# Altium schematic sheet Sheet1.SchDoc
size A4
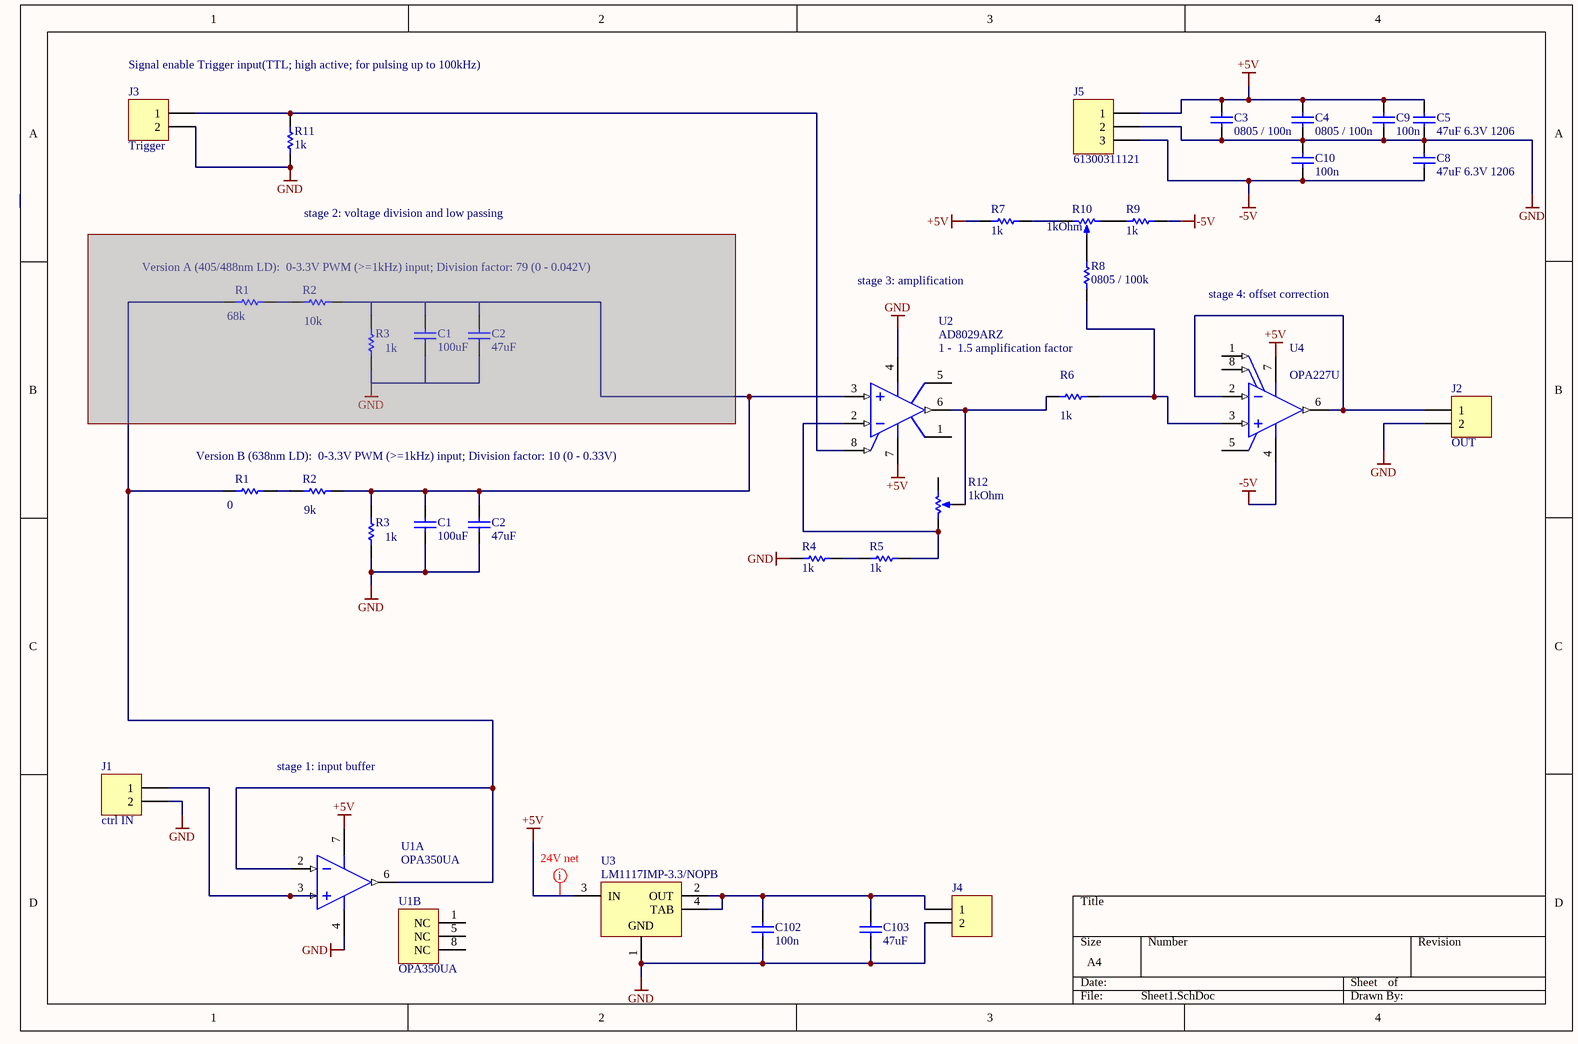
[diagram p0: Sheet1.SchDoc]

## Parts
(Parts that share a designator on the sheet are numbered #1, #2 ... from top to bottom, then left to right.)
C1#1  100uF  [CAPC1206(3216)190_L]  (masked out: inside a compile mask, not in the netlist)
C1#2  100uF  [CAPC1206(3216)190_L]
C2#1  47uF  [CAPC1206(3216)190_M]  (masked out: inside a compile mask, not in the netlist)
C2#2  47uF  [CAPC1206(3216)190_M]
C3  0805 / 100n  [CAPC2013X88X50LL20T25]
C4  0805 / 100n  [CAPC2013X88X50LL20T25]
C5  47uF 6.3V 1206  [CAPC1206(3216)190_M]
C8  47uF 6.3V 1206  [CAPC1206(3216)190_M]
C9  100n  [CAPC2013X88X50ML20T25]
C10  100n  [CAPC2013X88X50ML20T25]
C102  100n  [CAPC2013X88X50ML20T25]
C103  47uF  [CAPC1206(3216)190_M]
J1  ctrl IN  [61300211121]
J2  OUT  [61300211121]
J3  Trigger  [61300211121]
J4  potentiometer connect  [61300211121]  (value not drawn)
J5  61300311121  [61300311121]
R1#1  68k  [YAGO-RC0805_M]  (masked out: inside a compile mask, not in the netlist)
R1#2  0  [YAGO-RC0805_M]
R2#1  10k  [YAGO-RC0805_M]  (masked out: inside a compile mask, not in the netlist)
R2#2  9k  [YAGO-RC0805_M]
R3#1  1k  [YAGO-RC0805_M]  (masked out: inside a compile mask, not in the netlist)
R3#2  1k  [YAGO-RC0805_M]
R4  1k  [YAGO-RC0805_M]
R5  1k  [YAGO-RC0805_M]
R6  1k  [YAGO-RC0805_M]
R7  1k  [YAGO-RC0805_M]
R8  0805 / 100k  [YAGO-RC0805_M]
R9  1k  [YAGO-RC0805_M]
R10  1kOhm  [Typ 3296Y]
R11  1k  [YAGO-RC0805_M]
R12  1kOhm  [Typ 3296Y]
U1  OPA350UA  [D0008A_M]  (parts A,B of 2)
U2  AD8029ARZ  [ADI-R-8_L]
U3  LM1117IMP-3.3/NOPB  [DCY0004A_N]
U4  OPA227U  [D0008A_M]

## Nets
+5V: C3.2 C4.2 C5.2 C9.2 J5.1 R7.2 U1.7(V+) U2.7(+VS) U3.3(IN) U4.7(V+)
-5V: C8.1 C10.1 J5.3 R9.1 U4.4(V-)
GND: C1#2.1 C2#2.1 C3.1 C4.1 C5.1 C8.2 C9.1 C10.2 C102.1 C103.1 J1.2 J2.2 J3.2 J4.2 J5.2 R3#2.1 R4.2 R11.2 U1.4(V-) U2.4(-VS) U3.1(GND)
NetC1#2_2: C1#2.2 C2#2.2 R2#2.2 R3#2.2 U2.3(+IN)
NetC102_2: C102.2 C103.2 J4.1 U3.2(OUT) U3.4(TAB)
NetJ1_1: J1.1 U1.3(IN+)
NetJ2_1: J2.1 U4.2(IN-) U4.6(OUT)
NetJ3_1: J3.1 R11.1 U2.8(~{DISABLE})
NetR1#2_1: R1#2.1 U1.2(IN-) U1.6(OUT)
NetR1#2_2: R1#2.2 R2#2.1
NetR4_1: R4.1 R5.2
NetR5_1: R5.1 R12.3(CW) U2.2(-IN)
NetR6_1: R6.1 R8.1 U4.3(IN+)
NetR6_2: R6.2 R12.2(S) U2.6(VOUT)
NetR7_1: R7.1 R10.3(CW)
NetR8_2: R8.2 R10.2(S)
NetR9_2: R9.2 R10.1(CCW)

Not connected (* = marked no-connect by the designer): R12 1(CCW); U1 1(NC) 5(NC) 8(NC); U2 1(NC) 5(NC); U4 1(TRIM) 5(NC) 8(TRIM)

## Layout directives
net class 24V_net: +5V

## Notes on the sheet
- Signal enable Trigger input(TTL; high active; for pulsing up to 100kHz)
- stage 2: voltage division and low passing
- Version A (405/488nm LD):  0-3.3V PWM (>=1kHz) input; Division factor: 79 (0 - 0.042V)
- stage 3: amplification
- stage 4: offset correction
- 1 -  1.5 amplification factor
- Version B (638nm LD):  0-3.3V PWM (>=1kHz) input; Division factor: 10 (0 - 0.33V)
- stage 1: input buffer

## Library data of the parts
C1#1 C1#2 = CMP-00469-1: CAP 100uF 6.3V ±20% 1206 (3216 Metric) Thickness 1.9mm SMD; Tolerance: Â±20%; Case-EIA: 1206; Case-Metric: 3216; Technology: SMT; Max Thickness: 1.9 mm; Rated Voltage: 6.3 V; Value: 100uF
C2#1 C2#2 C5 C8 C103 = CMP-00470-A.1: CAP 47uF 6.3V ±20% 1206 (3216 Metric) Thickness 1.9mm SMD; Case-EIA: 1206; Case-Metric: 3216; Tolerance: Â±20%; Max Thickness: 1.9 mm; Value: 47uF; Technology: SMT; Rated Voltage: 6.3 V
C3 C4 = CMP-001-0082-1: generic_0805_example here 100nF: C0805C104K5RAC 7800 / SMD-Keramik-Vielschichtkondensator 100 nF, 50 VDC, 0805, ±10 %, X7R; Manufacturer: KEMET; Class: Class 1; Capacitance: 0.1 uF; Capacitance - nF: 100 nF; Capacitance - pF: 100000 pF; Tolerance: 10 %; Voltage Rating DC: 50 VDC; ComponentLink1Description: KEM_C1002_X7R_SMD-1102033.pdf; ComponentLink1URL: http://www.mouser.com/ds/2/212/KEM_C1002_X7R_SMD-1102033.pdf; Dielectric: X7R; Height: -; Length: 2 mm; Manufacturer Part Number: C0805C104K5RAC7800; Maximum Operating Temperature: + 125 C; Minimum Operating Temperature: - 55 C; Minimum Order Quantity: 4000; Package/Case: 0805 (2012 metric); Packaging: Reel; Product: General Type MLCCs; Reeling: True; RoHS - Mouser: Y; Series: C-C; Standard Pack Qty: 4000; Supplier: Mouser; Supplier Part Number: 80-C0805C104K5R7800; Brand: KEMET; Case Code - in: 0805; Case Code - mm: 2012; Termination: -; Termination Style: SMD/SMT; Voltage Rating AC: -; Width: 1.2 mm
C9 C10 C102 = CMP-001-0082-2: generic 0805 COG oder X7R Vielschichtkondensatoren max. +/-10%
J1-J4 = CMP-001-0071-1: 2Pol; gerade; WR-PHD 2.54 mm THT Pin Header; Brand: Wurth Electronics; Current Rating: 3 A; Insulation Resistance: 1 GOhms; Latching Type: Unlatched; Mating Post Length: 6 mm; Mounting Angle: Straight; Number of Positions: 2 Position; Pitch: 2.54 mm; Voltage Rating: 250 V; Accessory Type: -; Application: Wire to Board; ComponentLink1Description: 6130xx11121-538006.pdf; ComponentLink1URL: http://www.mouser.com/ds/2/445/6130xx11121-538006.pdf; Contact Gender: Pin (Male); Contact Material: Copper Alloy; Contact Plating: Gold; Contact Type: -; Flammability Rating: UL 94 V-0; Housing Gender: -; Housing Material: Polybutylene Terephthalate (PBT); Manufacturer: Wurth Electronics; Manufacturer Part Number: 61300211121; Minimum Order Quantity: 1; Mounting Style: Straight Pin; Number of Rows: 1 Row; Packaging: Bulk; Product: Headers; Reeling: False; RoHS - Mouser: Y; Row Spacing: -; Series: WR-PHD; Standard Pack Qty: 1000; Supplier: Mouser; Supplier Part Number: 710-61300211121; Termination Post Length: 3 mm; Termination Style: Through Hole; Type: Pin Strip; PartNumber: 61300211121
J5 = CMP-001-0072-1: 3Pol; gerade; WR-PHD 2.54 mm THT Pin Header; Brand: Wurth Electronics; Current Rating: 3 A; Insulation Resistance: 1 GOhms; Mating Post Length: 6 mm; Mounting Angle: Straight; Number of Positions: 3 Position; Pitch: 2.54 mm; Voltage Rating: 250 V; ComponentLink1Description: 6130xx11121-538006.pdf; ComponentLink1URL: http://www.mouser.com/ds/2/445/6130xx11121-538006.pdf; Contact Gender: Pin (Male); Contact Material: Copper Alloy; Contact Plating: Gold; Contact Type: -; Flammability Rating: UL 94 V-0; Housing Gender: -; Housing Material: Polyamide (PA); Manufacturer: Wurth Electronics; Manufacturer Part Number: 61300311121; Minimum Order Quantity: 1; Mounting Style: Straight Pin; Number of Rows: 1 Row; Packaging: Bulk; Product: Headers; Reeling: False; RoHS - Mouser: Y; Row Spacing: -; Series: WR-PHD; Standard Pack Qty: 1000; Supplier: Mouser; Supplier Part Number: 710-61300311121; Termination Post Length: 3 mm; Termination Style: Through Hole; Type: Pin Strip; PartNumber: 61300311121
R1#1 R1#2 R2#1 R2#2 R3#1 R3#2 R4-R9 R11 = CMP-001-0027-2: 0805 Yageo Standard BlackBox Resistors; Power (Watts): 0.125W, 1/8W; Temperature Coefficient: ±200ppm/°C; Tolerance: ±1%; ComponentLink1Description: PYu-RC_Group_51_RoHS_L_7.pdf; Part Status: Active; Size / Dimension: 0.079" L x 0.049" W (2.00mm x 1.25mm); Supplier Device Package: 0805; ComponentLink1URL: http://www.yageo.com/documents/recent/PYu-RC_Group_51_RoHS_L_7.pdf; Composition: Thick Film; Failure Rate: -; Features: Moisture Resistant; Height - Seated (Max): 0.024" (0.60mm); Manufacturer: Yageo; Operating Temperature: -55°C ~ 155°C; Package / Case: 0805 (2012 Metric); Packaging: Digi-Reel®
R10 R12 = CMP-001-0079-1: Trimmer_stehend_rechteckig_Verstellung-von-Seite; Manufacturer Part Number: 3296Y-1-102LF; Adjustment: Top Crossed; Brand: Bourns; Element Type: Cermet; Number of Turns: 25; Power Rating: 500 mW (1/2 W); Resistance: 1 kOhms; Temperature Coefficient: 100 PPM / C; Tolerance: 10 %; ComponentLink1Description: 296-776415.pdf; ComponentLink1URL: http://www.mouser.com/ds/2/54/296-776415.pdf; Length: 9.53 mm; Manufacturer: Bourns; Minimum Order Quantity: 1; Mounting: Panel Mount; Operating Temperature Range: - 55 C to + 150 C; Packaging: Tube; Product: Multiturn; Product Type: Square Trimming Potentiometer; Reeling: False; RoHS - Mouser: E; Series: 3296; Standard Pack Qty: 100; Supplier: Mouser; Supplier Part Number: 652-3296Y-1-102LF; Taper: Linear; Termination Style: Pin; Tradename: Trimpot; Type: Trimmers; Width: 9.53 mm; PartNumber: 3296Y-1-102LF
U1 = CMP-00488-1: High-Speed, Single-Supply, Rail-to-Rail Operational Amplifier MicroAmplifier(TM) Series, 2.7 to 5.5 V, -40 to 85 degC, 8-pin SOIC (D8), Green (RoHS & no Sb/Br); Manufacturer: Texas Instruments; IIB(Max)(pA): 10; Iq per channel(Max)(mA): 8.5; Number of Channels: 1; CMRR(Min)(dB): 66; Slew Rate(Typ)(V/us): 22; Total Supply Voltage(Max)(+5V is 5, +/-5V is 10): 5.5; Sub Family: Low Input Bias Current Amp (<=10pA), Low Offset Voltage Amplifier (<=500uV), Low Supply Voltage Amplifier (<=2.7V), Precision Amplifier; Offset Drift(Typ)(uV/C): 4; Total Supply Voltage(Min)(+5V is 5, +/-5V is 10): 2.7; Vn at 1kHz(Typ)(nV/rtHz): 18; PackageReference: D0008A; PackageDescription: 8-Pin Plastic Small Outline, Body 4.9 x 3.9 mm, Pitch 1.27 mm; Code_JEDEC: MS-012; Eco-Plan: Green (RoHS & no Sb/Br); DatasheetVersion: SBOS099C; Vio (25C)(Max)(mV): 1; ComponentLink1URL: http://www.ti.com/; ComponentLink3URL: http://www.ti.com/litv/pdf/msoi002j; PackageVersion: 4040047-3/M, 06/2011; ComponentLink3Description: Package Specification; ComponentLink2URL: http://www.ti.com/general/docs/lit/getliterature.tsp?genericPartNumber=OPA350&fileType=pdf; PartNumber: OPA350UA; ComponentLink2Description: Datasheet; ComponentLink1Description: Manufacturer URL; Mounting Technology: Surface Mount
U2 = CMP-00480-1: Single Channel RRIO Operational Amplifier, 125 MHz BW, 62 V/us SR, Industrial, 8-pin SOIC (R-8), Tube; Manufacturer: Analog Devices; Generic Part Number: AD8029; Slew Rate: 62V/us; V Span Min: 2.7V; Input Bias Current: 700nA; Amplifiers Per Package: 1; Iq/Amp: 1.5mA; V Span Max: 12V; Input Offset Voltage: 1.6mV; Small Signal Bandwidth: 125MHz; PackageVersion: 060506-A; ComponentLink3URL: http://www.analog.com/static/imported-files/packages/PKG_PDF/SOIC_Narrow%20(R)/R_8.pdf; ComponentLink1Description: Manufacturer URL; ComponentLink1URL: http://www.analog.com/en/index.html; Code_JEDEC: MS-012-AA; ComponentLink2URL: http://www.analog.com/static/imported-files/data_sheets/AD8029_8030_8040.pdf; ComponentLink3Description: Package Specification; PackageDescription: 8-Pin Standard Small Outline Package, Body 3.9 x 4.9 mm, Pitch 1.27 mm; PartNumber: AD8029ARZ; Mounting Technology: Surface Mount; PackageReference: R-8; DatasheetVersion: Rev. B; ComponentLink2Description: Datasheet
U3 = CMP-00484-1: 800mA Low-Dropout Linear Regulator, 4-pin SOT-223, Pb-Free; Manufacturer: Texas Instruments; PackageTopMarking: XYTT*N05B; PowerWise: N; High-Reliability: Y; CompType: LDO IC; Code_IPC: SOT223-4; PackageReference: DCY0004A; PinCount: 4; PackageDescription: Molded SOT-223, 6.50 x 3.56 x 1.6mm Body, 4 Lead, 2.3mm Pitch; PartNumber: LM1117IMP-3.3/NOPB; RoHS: Y; ComponentLink1Description: Datasheet URL; Code_JEDEC: TO-261-AA; ComponentLink1URL: http://www.ti.com/general/docs/lit/getliterature.tsp?genericPartNumber=LM1117-N&fileType=pdf
U4 = CMP-00481-1: High Precision, Low Noise Operational Amplifier, 5 to 36 V, -55 to 125 degC, 8-pin SOIC (D8), Green (RoHS & no Sb/Br); Manufacturer: Texas Instruments; GBW(Typ)(MHz): 8; Slew Rate(Typ)(V/us): 2.3; Packing: TUBE; Total Supply Voltage(Min)(+5V is 5, +/-5V is 10): 5; Iq per channel(Max)(mA): 3.8; Total Supply Voltage(Max)(+5V is 5, +/-5V is 10): 36; IIB(Max)(pA): 10000; CMRR(Min)(dB): 120; Rating: Catalog; Sub Family: High Supply Voltage Amplifier (>=30V), Low Noise Amp (<=10nV/rtHz), Low Offset Voltage Amplifier (<=500uV), Precision Amplifier; Vio (25C)(Max)(mV): 0.075; Number of Channels: 1; Offset Drift(Typ)(uV/C): 0.1; ComponentLink2URL: http://www.ti.com/lit/ds/symlink/opa227.pdf; ComponentLink1URL: http://www.ti.com/; Code_JEDEC: MS-012; PackageDescription: 8-Pin Plastic Small Outline, Body 4.9 x 3.9 mm, Pitch 1.27 mm; ComponentLink2Description: Datasheet; Mounting Technology: Surface Mount; PackageReference: D0008A; Eco-Plan: Green (RoHS & no Sb/Br); PackageVersion: 4040047-3/M, 06/2011; ComponentLink1Description: Manufacturer URL; ComponentLink3URL: http://www.ti.com/litv/pdf/msoi002j; ComponentLink3Description: Package Specification; PartNumber: OPA227U; DatasheetVersion: SBOS110A